# EAGLE design PCB PUMP ATTINY (EAGLE 9.5.2)
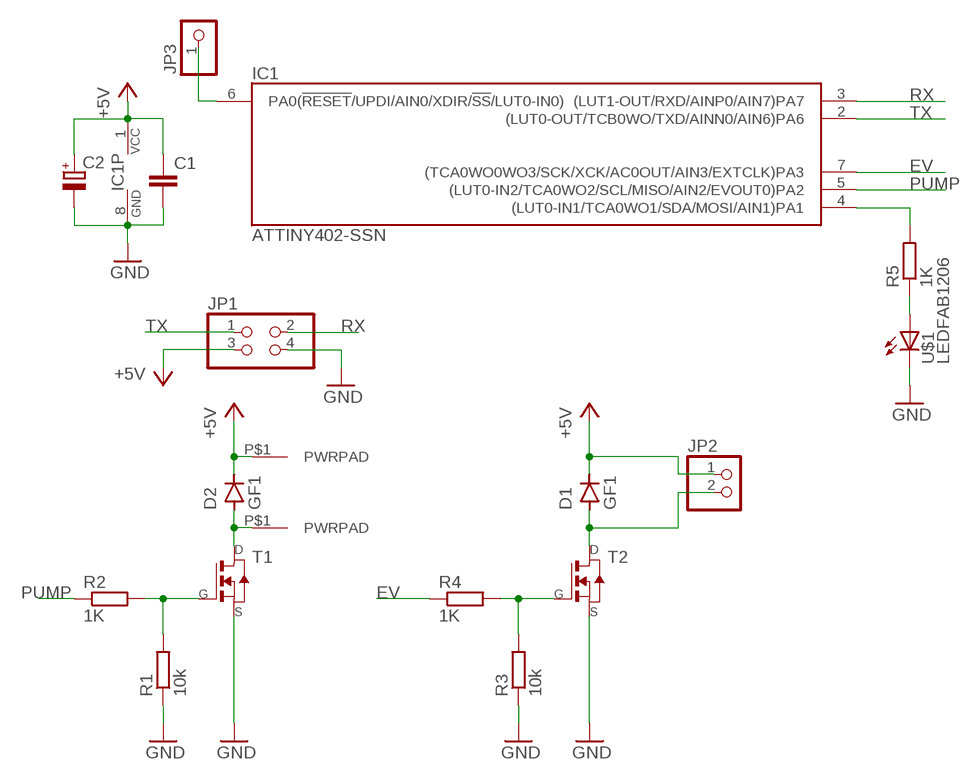
[diagram p0: schematic, sheet 1]

## Parts
C1  C-EUC1206  [C1206]
C2  CPOL-EU153CLV-0505  [153CLV-0505]
D1  GF1  [SMA-DO214AC]
D2  GF1  [SMA-DO214AC]
IC1  ATTINY402-SSN  [SO8]
J3  PWRPAD2-5MM  [PWRPAD_2-5MM]
J4  PWRPAD2-5MM  [PWRPAD_2-5MM]
JP1  PINHD-2X02_2.54-SMD  [2X02SMD]
JP2  PINHD-1X02_2.54-SMD-90°  [1X02SMD/90]
JP3  PINHD-1X01_2.54-SMD  [1X01SMD]
R1  10k  R-EU_R1206  [R1206]
R2  1K  R-EU_R1206  [R1206]
R3  10k  R-EU_R1206  [R1206]
R4  1K  R-EU_R1206  [R1206]
R5  1K  R-EU_R1206  [R1206]
T1  NMOSFETSOT23  [SOT-23]
T2  NMOSFETSOT23  [SOT-23]
U$1  LEDFAB1206  [LED1206FAB]

## Nets
+5V: C1.1 C2.+ D1.K(C) D2.K(C) IC1.1(VCC) J4.P$1(PWRPAD) JP1.3 JP2.1
EV: IC1.7((TCA0WO0WO3/SCK/XCK/AC0OUT/AIN3/EXTCLK)PA3) R4.1
GND: C1.2 C2.- IC1.8(GND) JP1.4 R1.1 R3.1 T1.2(S) T2.2(S) U$1.2(C)
N$1: D1.A JP2.2 T2.1(D)
N$2: D2.A J3.P$1(PWRPAD) T1.1(D)
N$3: R1.2 R2.2 T1.3(G)
N$4: R3.2 R4.2 T2.3(G)
N$5: IC1.6(PA0(!RESET!/UPDI/AIN0/XDIR/!SS!/LUT0-IN0)) JP3.1
N$6: R5.1 U$1.1(A)
N$7: IC1.4((LUT0-IN1/TCA0WO1/SDA/MOSI/AIN1)PA1) R5.2
PUMP: IC1.5((LUT0-IN2/TCA0WO2/SCL/MISO/AIN2/EVOUT0)PA2) R2.1
RX: IC1.3((LUT1-OUT/RXD/AINP0/AIN7)PA7) JP1.2
TX: IC1.2((LUT0-OUT/TCB0WO/TXD/AINN0/AIN6)PA6) JP1.1

## Library data of the parts
C1 = rcl:C-EU: CAPACITOR, European symbol; SPICEPREFIX: C
C2 = rcl:CPOL-EU: POLARIZED CAPACITOR, European symbol; SPICEPREFIX: C
D1 D2 = diode:GF1: DIODE
IC1 = atmel:ATTINY*02: 8-bit AVR tiny-0-series Microcontroller CPU: two-cycle hardware multiplier single pin Unified Program Debug Interface (UPDI) programmable watchdog timer with separate on-chip oscillator programmable brown-out detection circuit with software disable function internal calibrated oscillator Status active active ATtiny202 ATtiny402 General purpose working registers 32 SRAM 128 B 256 B Flash 2 kB 4 kB EEPROM 64 B 128 B 16-bit Timer/Counter type A (TCA) 1 16-bit Timer/Counter type B (TCB) 1 Real Time Counter (RTC) 1 USART 1 SPI 1 TWI (I2C) 1 ADC 1 ADC channels 6 ADC resolution 10 bit AC 1 Custom Configurable Logic/Lookup tables 1/2 Window Watchdog 1 Event System channels 3 General purpose I/O 6 External interrupts 6 CRCSCAN 1 Operating voltage 1.8 ... 5.5 V Speed grade 0 ... 5 MHz @ 1.8 ... 5.5 V 0 ... 10 MHz @ 2.7 ... 5.5 V 0 ... 20 MHz @ 4.5 ... 5.5 V Clock options internal 16/20 MHz low power RC oscillator internal 32.768 kHz ultra low power RC oscillator external clock input Pin Name Other/Special ADC0 AC0 USART0 SPI0 TWI0 TCA0 TCB0 CCL PA0 !RESET, UPDI AIN0 XDIR !SS LUT0-IN0 PA1 AIN1 TxD MOSI SDA WO1 LUT0-IN1 PA2 EVOUT0 AIN2 RxD MISO SCL WO2 LUT0-IN2 PA3 EXTCLK AIN3 OUT XCK SCK WO0/WO3 PA6 AIN6 AINN0 TxD MOSI WO LUT0-OUT PA7 AIN7 AINP0 RxD MISO WO0 LUT1-OUT
J3 J4 = fab:PWRPAD
JP1 = pinhead-2:PINHD-2X02: PIN HEADER
JP2 = pinhead-2:PINHD-1X02: PIN HEADER
JP3 = pinhead-2:PINHD-1X01: PIN HEADER
R1-R5 = rcl:R-EU_: RESISTOR, European symbol; SPICEPREFIX: R
T1 T2 = fab:NMOSFET: MOS FET
U$1 = fab:LED: LED

## Board
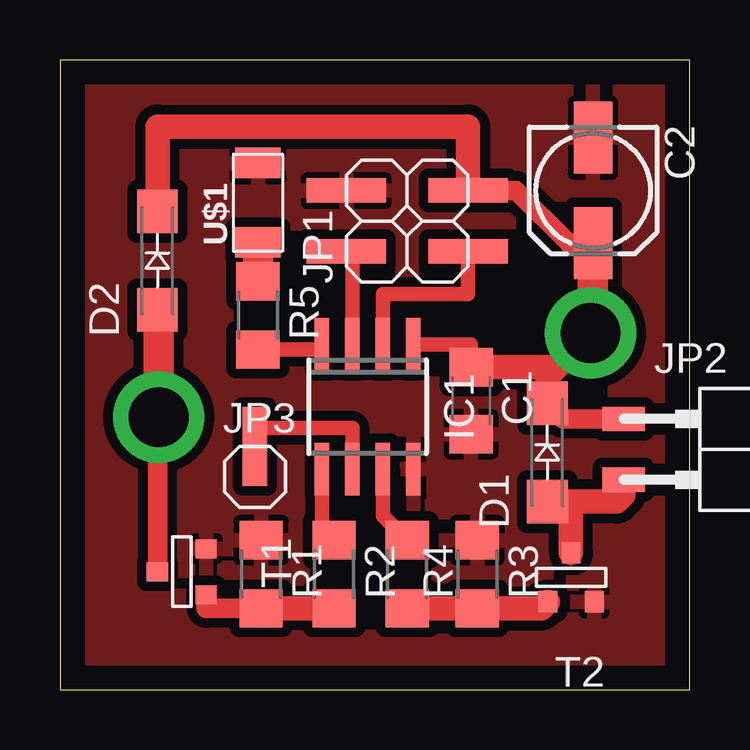
[diagram p1: board, top side]

Size 26.27 x 26.27 mm. Coordinates in mm from the lower left corner, seen from the top.
Outline: 0,0 26.27,0 26.27,26.27 0,26.27 0,0
Copper layers (1*16): Top 0.035mm / dielectric 1.5mm / Bottom 0.035mm
Design rules "default": minimum track width 6mil, minimum drill 0.35mm, track to track 6mil, track to pad 6mil, pad to pad 6mil, via to via 6mil, smd to smd 6mil, copper to edge 40mil, drill to drill 6mil, minimum pad ring 10mil, minimum via ring 8mil, stop-mask expansion 4mil, vias tented up to drill 0mil, thermal gap 10mil

### Footprints (pad centres in the part's own frame; a part is rotated, then mirrored left to right if it is on the bottom)
C1206 = smd 1.6 x 1.8: 1 -1.4,0; 2 1.4,0
153CLV-0505 = smd 3 x 1.6: + 2.2,0; - -2.2,0
SMA-DO214AC = smd 1.8 x 1.7: A -2.05,0; K 2.05,0
SO8 = smd 0.6 x 2.2: 1 -1.905,-2.6; 2 -0.635,-2.6; 3 0.635,-2.6; 4 1.905,-2.6; 5 1.905,2.6; 6 0.635,2.6; 7 -0.635,2.6; 8 -1.905,2.6
PWRPAD_2-5MM = drill 2.489 pad 3.81: P$1 0,0
2X02SMD = smd 1.016 x 3.302: 1 -1.27,-3.81; 2 -1.27,1.27; 3 1.27,-3.81; 4 1.27,1.27
1X02SMD/90 = smd 1.016 x 1.778: 1 -1.27,-5.08; 2 1.27,-5.08
1X01SMD = smd 1.016 x 3.302: 1 -1.27,1.27
R1206 = smd 1.6 x 1.803: 1 -1.422,0; 2 1.422,0
SOT-23 = smd 0.787 x 0.889: 1 0.025,-1.016; 2 -0.94,1.016; 3 0.991,1.016
LED1206FAB = smd 1.27 x 1.905: 1 -1.651,0; 2 1.651,0

### Placement (x,y rotation side)
C1  17.15,12.06 270 top
C2  22.23,20.83 270 top
D1  20.32,9.91 90 top
D2  4.06,17.91 90 top
IC1  12.83,11.81 180 top
J3  4.11,11.38 0 top
J4  22.12,14.88 0 top
JP1  13.21,19.56 90 top
JP2  28.58,10.03 270 top
JP3  9.4,8.89 0 top
R1  8.38,4.83 270 top
R2  11.43,4.83 270 top
R3  17.4,4.83 270 top
R4  14.48,4.83 270 top
R5  8.26,15.62 270 top
T1  5.08,4.95 270 top
T2  21.34,4.7 180 top
U$1  8.26,20.32 90 top

### Tracks (layer width: path | path; a pad name or v marks a point on that pad's centre or on a via)
+5V
  Top 0.508: IC1.1 14.73,14.54
  Top 0.61: IC1.1 17.15,14.41 C1.1
  Top 0.813: JP2.1 20.97,11.3 D1.K | JP1.3 19.01,20.83 21.21,18.63 C2.+
  Top 1.016: D1.K 20.32,13.08 J4.P$1 20.7,13.46 C1.1 | D2.K 4.06,23.5 17.02,23.5 JP1.3
  Top 1.27: C2.+ 22.23,14.99 J4.P$1
EV
  Top 0.61: R4.1 13.46,7.26 IC1.7
GND
  pour Top (isolate 0.406): -0.64,26.67 27.31,26.67 27.31,-0.64 -0.64,-0.64
N$1
  Top 1.016: JP2.2 23.5,8.13 23.22,7.86 20.96,7.86 | 20.96,7.86 D1.A | T2.1 21.31,7.5 20.96,7.86
N$2
  Top 0.813: T1.1 4.06,11.33 J3.P$1 | 4.12,15.81 D2.A
  Top 1.27: J3.P$1 4.12,15.81
N$3
  Top 0.813: R1.2 6.1,3.4 T1.3
  Top 1.016: R2.2 R1.2
N$4
  Top 1.016: R4.2 R3.2 20.07,3.4 T2.3
N$5
  Top 0.61: IC1.6 12.19,10.92 8.13,10.92 JP3.1
N$6
  Top 1.27: R5.1 U$1.1
N$7
  Top 0.508: IC1.4 10.71,14.2
  Top 0.61: 10.71,14.2 R5.2
PUMP
  Top 0.508: R2.1 11.43,6.35 10.92,6.86
  Top 0.61: IC1.5 10.92,6.86
RX
  Top 0.508: 12.19,18.03 JP1.2
  Top 0.61: IC1.3 12.19,18.03
TX
  Top 0.508: 15.62,18.29 JP1.1
  Top 0.61: JP1.1 17.02,16.51 13.46,16.51 IC1.2